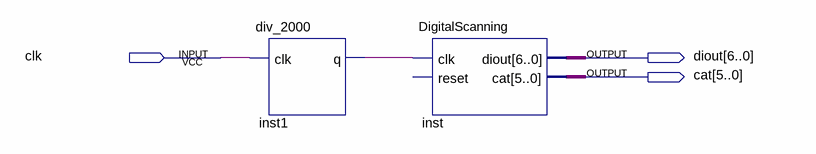
[diagram p0: schematic sheet]
// Quartus schematic Block1.bdf as structural Verilog: 2 symbols, 3 pins
module Block1 (
  input  clk,
  output [6:0] diout,
  output [5:0] cat
);

  wire inst1_q;

  div_2000 inst1 (.clk(clk), .q(inst1_q));
  DigitalScanning inst (.clk(inst1_q), .diout(diout), .cat(cat));  // open: reset
endmodule
